# EAGLE design co2_temp (EAGLE 9.5.1)
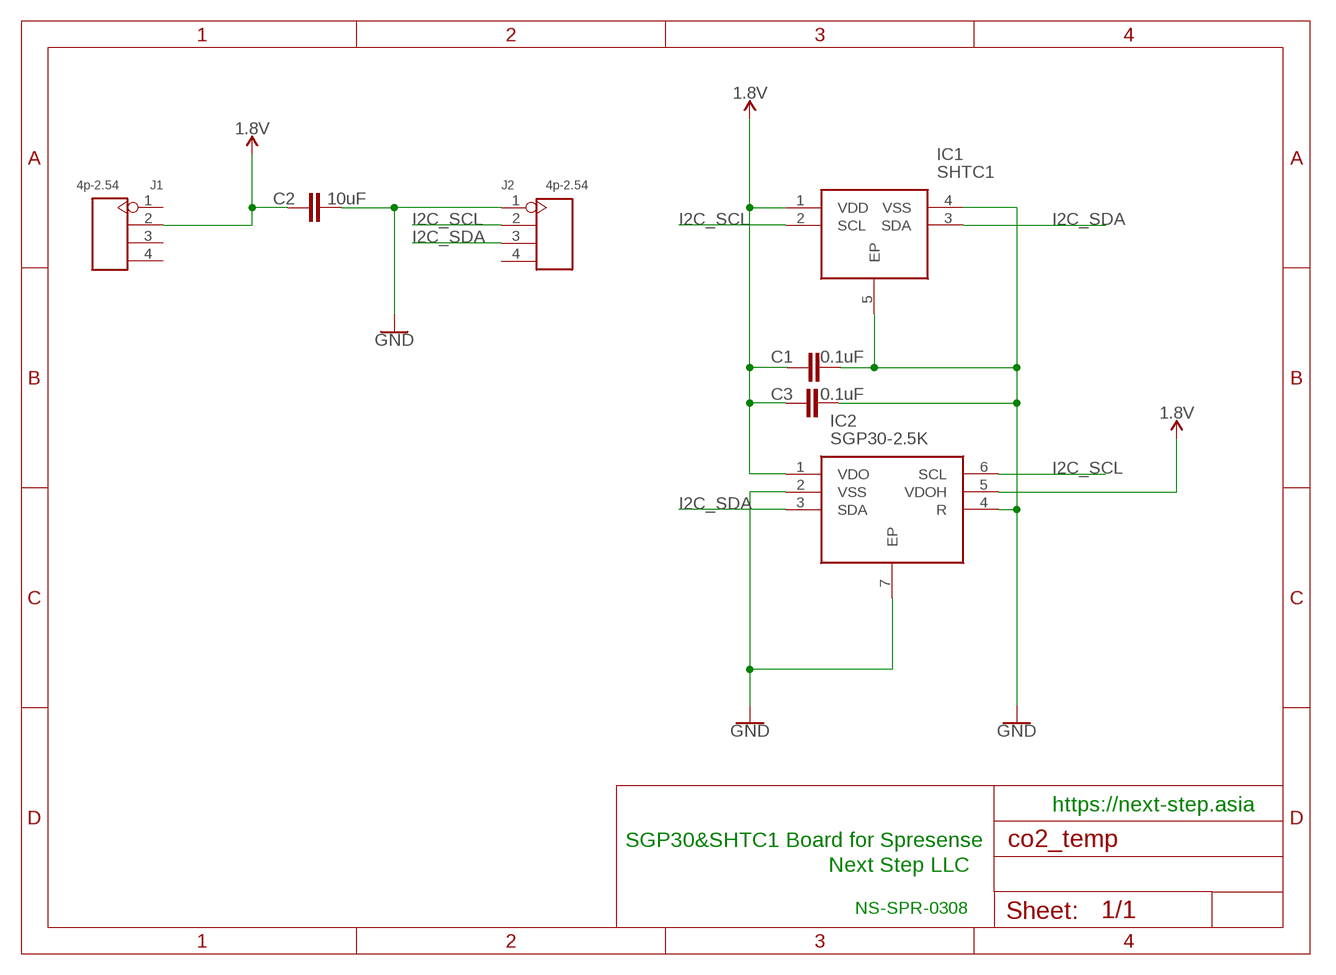
[diagram p0: schematic, sheet 1]

## Parts
C1  0.1uF  0.1UF-0603-25V-5%  [0603]
C2  10uF  10UF-0603-6.3V-20%  [0603]
C3  0.1uF  0.1UF-0603-25V-5%  [0603]
IC1  SHTC1  [SON100P200X200X7500-5N]
IC2  SGP30-2.5K  [SON80P245X245X90-7N]
J1  4p-2.54  DIP-BLACK-FEMALE-HEADER-VERT(4P-2.54)  [H4-2.54]
J2  4p-2.54  DIP-BLACK-FEMALE-HEADER-VERT(4P-2.54)  [H4-2.54]

## Nets
1.8V: C1.1 C2.1 C3.1 IC1.1(VDD) IC2.1(VDO) IC2.5(VDOH) J1.2
GND: C1.2 C2.2 C3.2 IC1.4(VSS) IC1.5(EP) IC2.2(VSS) IC2.4(R) IC2.7(EP) J2.1
I2C_SCL: IC1.2(SCL) IC2.6(SCL) J2.2
I2C_SDA: IC1.3(SDA) IC2.3(SDA) J2.3
Unconnected: J1.1 J1.3 J1.4 J2.4

## Notes on the sheet
- https://next-step.asia
- SGP30&SHTC1 Board for Spresense
- Next Step LLC
- NS-SPR-0308

## Library data of the parts
C1 C3 = SparkFun-Capacitors:0.1UF: 0.1µF ceramic capacitors A capacitor is a passive two-terminal electrical component used to store electrical energy temporarily in an electric field.; PROD_ID: CAP-08604
C2 = SparkFun-Capacitors:10UF: 10.0µF ceramic capacitors A capacitor is a passive two-terminal electrical component used to store electrical energy temporarily in an electric field.; PROD_ID: CAP-11015
IC1 = SamacSys_Parts:SHTC1: Temperature Humidity Sensor Digital DFN4 Sensirion SHTC1 Temperature & Humidity Sensor 4-Pin DFN, -40 +125 C Source: Datasheet; DESCRIPTION: Temperature Humidity Sensor Digital DFN4 Sensirion SHTC1 Temperature & Humidity Sensor 4-Pin DFN, -40 +125 C; HEIGHT: 75mm; MANUFACTURER_NAME: Sensirion; MANUFACTURER_PART_NUMBER: SHTC1; MOUSER_PART_NUMBER: 403-SHTC1; MOUSER_PRICE-STOCK: https://www.mouser.co.uk/ProductDetail/Sensirion/SHTC1?qs=Mn9EN1AKrqQgZpobGSD1iQ%3D%3D
IC2 = SamacSys_Parts:SGP30-2.5K: Air Quality Sensors Multi-Pixel SGP Gas Sensor Source: Datasheet; DESCRIPTION: Air Quality Sensors Multi-Pixel SGP Gas Sensor; HEIGHT: 0.9mm; MANUFACTURER_NAME: Sensirion; MANUFACTURER_PART_NUMBER: SGP30-2.5k; MOUSER_PART_NUMBER: 403-SGP30-2.5K; MOUSER_PRICE-STOCK: https://www.mouser.co.uk/ProductDetail/Sensirion/SGP30-25k?qs=HXFqYaX1Q2xVSiHQfO6Ujg%3D%3D
J1 J2 = Seeed-Connector:DIP-BLACK-FEMALE-HEADER-VERT(4P-2.54): 320030017; MPN: F185-1104A1BSYA1

## Board
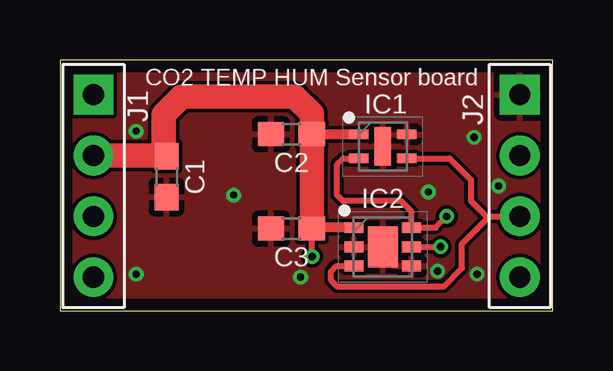
[diagram p1: board, top side]
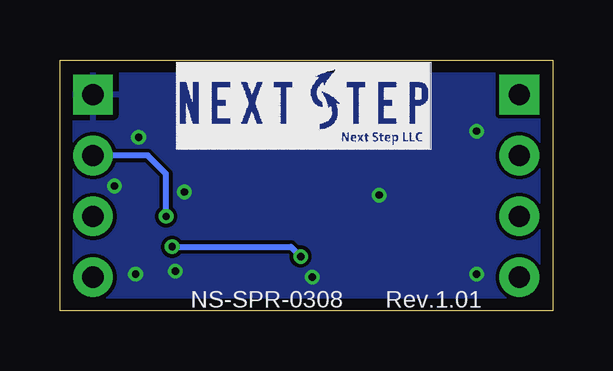
[diagram p2: board, bottom side, seen from below]

Size 20.55 x 10.46 mm. Coordinates in mm from the lower left corner, seen from the top.
Outline: 0,0 20.55,0 20.55,10.46 0,10.46 0,0
Copper layers (1*16): Top 0.035mm / dielectric 1.6mm / Bottom 0.035mm
Design rules "Elecrow_2-layer_PCB_eagle_rule": minimum track width 6mil, minimum drill 12mil, track to track 6mil, track to pad 6mil, pad to pad 6mil, via to via 8mil, smd to smd 0mil, copper to edge 20mil, drill to drill 10mil, minimum pad ring 6mil, minimum via ring 6mil, stop-mask expansion 0mil, vias tented up to drill 100mil, thermal gap 10mil

### Footprints (pad centres in the part's own frame; a part is rotated, then mirrored left to right if it is on the bottom)
0603 = smd 1.1 x 1: 1 -0.85,0; 2 0.85,0
SON100P200X200X7500-5N = smd 0.8 x 0.4: 1 -1,0.5; 2 -1,-0.5; 3 1,-0.5; 4 1,0.5 | smd 0.7 x 1.6: 5 0,0
SON80P245X245X90-7N = smd 0.8 x 0.45: 1 -1.2,0.8; 2 -1.2,0; 3 -1.2,-0.8; 4 1.2,-0.8; 5 1.2,0; 6 1.2,0.8 | smd 1.25 x 1.7: 7 0,0
H4-2.54 = drill 0.889 pad 1.651 square: 1 0,3.81 | drill 0.889 pad 1.651: 2 0,1.27; 3 0,-1.27; 4 0,-3.81

### Placement (x,y rotation side)
C1  4.44,5.59 270 top
C2  9.65,7.37 180 top
C3  9.65,3.43 180 top
IC1  13.46,6.86 0 top
IC2  13.46,2.67 0 top
J1  1.4,5.21 0 top
J2  19.18,5.21 0 top

### Tracks (layer width: path | path; a pad name or v marks a point on that pad's centre or on a via)
1.8V  (via drill 0.3)
  Top 0.254: IC2.5 v15.87,2.67 | v10.52,2.26 10.52,3.42 C3.1
  Top 0.406: IC1.1 10.51,7.36 C2.1 | IC2.1 10.54,3.47 C3.1
  Top 1.016: C3.1 C2.1 10.5,8.22 9.78,8.94 5.08,8.94 4.32,8.18 4.32,6.56 C1.1 4.41,6.48 J1.2
  Bottom 0.254: v10.52,2.26 10.92,2.67 v15.87,2.67
GND  (via drill 0.3)
  other vias: 3.17,7.49 3.17,1.52 7.24,4.83 10.03,1.4 17.4,1.52 18.29,5.21 17.27,7.24 15.37,4.95 15.75,1.65
  pour Top: 0,10.54 20.57,10.54 20.57,-0.13 0,-0.13
  pour Bottom: 0,10.54 20.57,10.54 20.57,-0.13 0,-0.13
I2C_SCL  (via drill 0.3)
  Top 0.254: IC1.2 11.82,6.36 11.56,6.1 11.56,4.83 11.81,4.57 14.22,4.57 14.66,4.13 IC2.6 15.66,3.47 v16.13,3.94
  Bottom 0.254: v16.13,3.94 16.13,5.71 16.89,6.48 J2.2
I2C_SDA
  Top 0.254: 17.91,3.94 16.76,2.79 16.76,1.78 16,1.02 11.56,1.02 11.3,1.27 11.3,1.65 11.52,1.87 IC2.3 | 17.91,3.94 J2.3 | IC1.3 16.25,6.36 17.14,5.46 17.14,4.57 17.78,3.94 17.91,3.94

### Text on the board
tPlace: CO2 TEMP HUM Sensor board
bPlace: Rev.1.01 | NS-SPR-0308